# Altium schematic sheet power.SchDoc
size A4; SheetNumber: 2; SheetTotal: 5
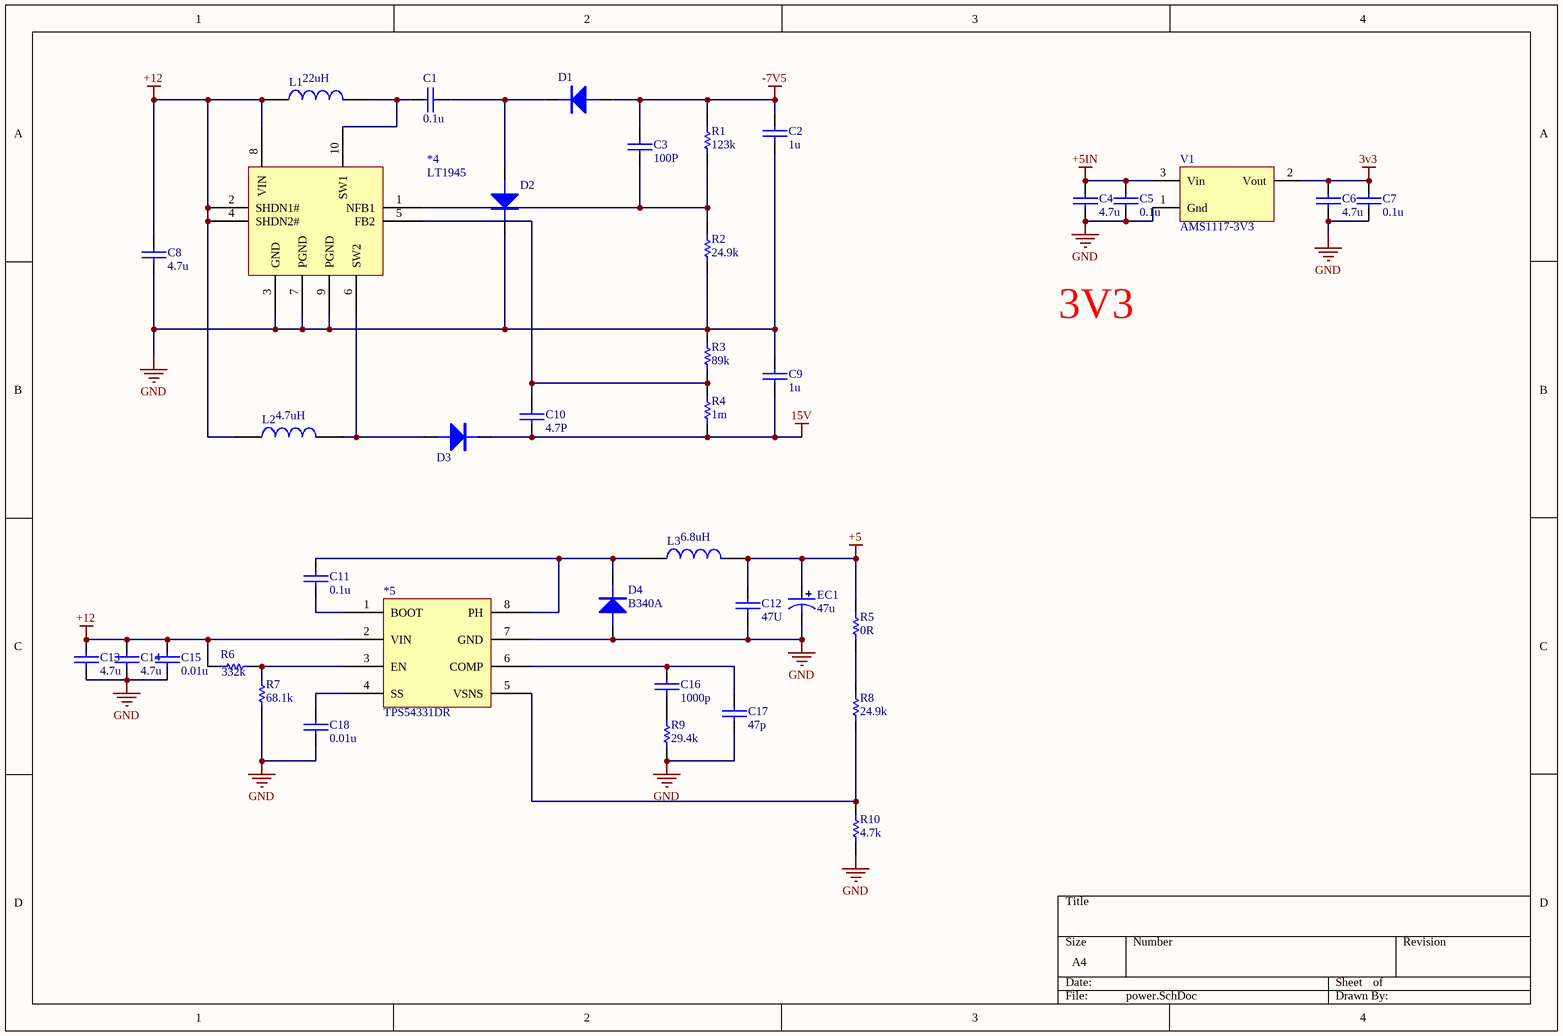
[diagram p0: power.SchDoc]

## Parts
*4  LT1945  [LT1945EMS]
*5  TPS54331DR  [SOIC-8]
C1  0.1u  [0603C]
C2  1u  [0603C]
C3  100P  [0603C]
C4  4.7u  [0603C]
C5  0.1u  [0603C]
C6  4.7u  [0603C]
C7  0.1u  [0603C]
C8  4.7u  [0603C]
C9  1u  [0603C]
C10  4.7P  [0603C]
C11  0.1u  [0603C]
C12  47U  [0603C]
C13  4.7u  [0603C]
C14  4.7u  [0603C]
C15  0.01u  [0603C]
C16  1000p  [0603C]
C17  47p  [0603C]
C18  0.01u  [0603C]
D1  B340A  [SMA/DO-214AC]  (value not drawn)
D2  B340A  [SMA/DO-214AC]  (value not drawn)
D3  B340A  [SMA/DO-214AC]  (value not drawn)
D4  B340A  [SMA/DO-214AC]
EC1  47u  [SMD-EC6.3X6.3X10]
L1  22uH  [L-SMD-0630]
L2  4.7uH  [L-SMD-0630]
L3  6.8uH  [L-SMD-0630]
R1  123k  [0603R]
R2  24.9k  [0603R]
R3  89k  [0603R]
R4  1m  [0603R]
R5  0R  [0603R]
R6  332k  [0603R]
R7  68.1k  [0603R]
R8  24.9k  [0603R]
R9  29.4k  [0603R]
R10  4.7k  [0603R]
V1  AMS1117-3V3  [SOT223_L]

## Nets
3v3: C6.2 C7.2 V1.2(Vout)
15V: C9.2 C10.2 D3.K R4.2
+5: C12.2 EC1.1 L3.2 R5.2
+5IN: C4.2 C5.2 V1.3(Vin)
+12: *4.2(SHDN1#) *4.4(SHDN2#) *4.8(VIN) *5.2(VIN) C8.1 C13.2 C14.2 C15.2 L1.1 L2.1 R6.2
-7V5: C2.1 C3.1 D1.A R1.2
GND: *4.3(GND) *4.7(PGND) *4.9(PGND) *5.7(GND) C2.2 C4.1 C5.1 C6.1 C7.1 C8.2 C9.1 C12.1 C13.1 C14.1 C15.1 C17.1 C18.1 D2.K D4.A EC1.2 R2.1 R3.2 R7.1 R9.1 R10.1 V1.1(Gnd)
Net*4_1: *4.1(NFB1) C3.2 R1.1 R2.2
Net*4_5: *4.5(FB2) C10.1 R3.1 R4.1
Net*4_6: *4.6(SW2) D3.A L2.2
Net*4_10: *4.10(SW1) C1.1 L1.2
Net*5_1: *5.1(BOOT) C11.1
Net*5_3: *5.3(EN) R6.1 R7.2
Net*5_4: *5.4(SS) C18.2
Net*5_5: *5.5(VSNS) R8.1 R10.2
Net*5_6: *5.6(COMP) C16.2 C17.2
Net*5_8: *5.8(PH) C11.2 D4.K L3.1
NetC1_2: C1.2 D1.K D2.A
NetC16_1: C16.1 R9.2
NetR5_1: R5.1 R8.2

## Notes on the sheet
- 3V3

## Library data of the parts
*4 = LT1945: 双通道升降压DCDC
*5 = TPS54331DR: 降压型DC-DC
C1-C18 = CAP: 无极性电容
D1-D4 = DIODE: 普通二极管
EC1 = ECAP: 贴片电解电容
L1-L3 = L: INDUCTOR
R1-R10 = RES: 电阻
V1 = AMS1117: LDO; BOM名称: 稳压芯片; 封装库来自淘宝卖家：黄晶宝石: 其他店铺购入的买家，请立即申请退款，本店现金奖励200~1000元